# Altium project TinyTOF-Body.PrjPcb
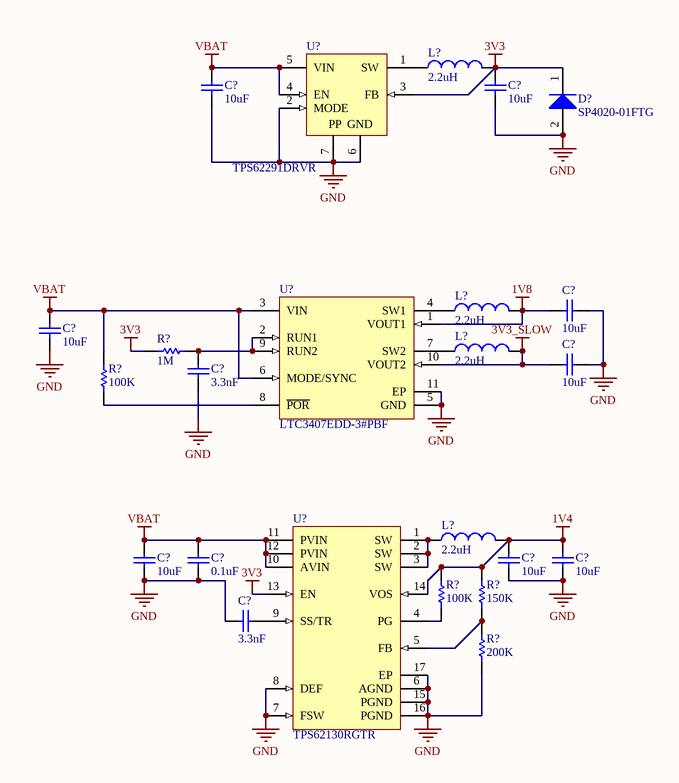
[diagram p0: Supplies.SchDoc]
4 sheets, 103 parts. Net scope: flat (ports and power ports of the same name join across sheets).
Board file: TinyTOF-Body.PcbDoc
Sheets:
  Supplies.SchDoc
  MPU-Power.SchDoc
  MPU-Memory.SchDoc
  MPU-Control.SchDoc

## Sheet Supplies.SchDoc
size A

### Parts
(Parts that share a designator on the sheet are numbered #1, #2 ... from top to bottom, then left to right.)
C61  value 10uF  [C0402[1005X55]]  (hidden comment: 10uF 6.3V 0402)
C62  value 10uF  [C0402[1005X55]]  (hidden comment: 10uF 6.3V 0402)
C63  value 10uF  [C0402[1005X55]]  (hidden comment: 10uF 6.3V 0402)
C64  value 10uF  [C0402[1005X55]]  (hidden comment: 10uF 6.3V 0402)
C65  value 10uF  [C0402[1005X55]]  (hidden comment: 10uF 6.3V 0402)
C66  value 3.3nF  [C0402[1005X55]]  (hidden comment: 3.3nF 50V 0402)
C67  value 10uF  [C0402[1005X55]]  (hidden comment: 10uF 6.3V 0402)
C68  value 0.1uF  [C0402[1005X55]]  (hidden comment: 0.1uF 6.3V 0402)
C69  value 10uF  [C0402[1005X55]]  (hidden comment: 10uF 6.3V 0402)
C70  value 10uF  [C0402[1005X55]]  (hidden comment: 10uF 6.3V 0402)
C71  value 3.3nF  [C0402[1005X55]]  (hidden comment: 3.3nF 50V 0402)
D?  SP4020-01FTG  [SOD323]
L1  2.2uH  [IND0805]
L2  2.2uH  [IND0603]
L3  2.2uH  [IND0603]
L4  2.2uH  [IND1008]
R22  value 1M  [R0402[1005]]  (hidden comment: 1M 1% 0402)
R23  value 150K  [R0402[1005]]  (hidden comment: 150K 1% 0402)
R24  value 200K  [R0402[1005]]  (hidden comment: 200K 1% 0402)
R?#1  value 100K  [R0402[1005]]  (hidden comment: 100K 1% 0402)
R?#2  value 100K  [R0402[1005]]  (hidden comment: 100K 1% 0402)
U6  TPS62291DRVR  [WSON-6]
U7  LTC3407EDD-3#PBF  [LT-DD-10_V]
U8  TPS62130RGTR  [RGT0016C_V]

### Nets
1V4: C69.2 C70.2 L4.2 R23.2 R?#2.2 U8.14(VOS)
1V8: C63.2 L2.2 U7.1(VOUT1)
3V3: C62.2 D?.1(K) L1.2 R22.2 U6.3(FB) U8.13(EN)
3V3_SLOW: C65.1 L3.2 U7.10(VOUT2)
GND: C61.1 C62.1 C63.1 C64.1 C65.2 C66.1 C67.1 C68.1 C69.1 C70.1 C71.1 D?.2(A) R24.1 U6.2(MODE) U6.6(GND) U6.7(EP) U7.5(GND) U7.11(EP) U8.6(AGND) U8.7(FSW) U8.8(DEF) U8.15(PGND) U8.16(PGND) U8.17(EP)
VBAT: C61.2 C64.2 C67.2 C68.2 R?#1.2 U6.4(EN) U6.5(VIN) U7.3(VIN) U7.6(MODE/SYNC) U8.10(AVIN) U8.11(PVIN) U8.12(PVIN)
NetC66_2: C66.2 R22.1 U7.2(RUN1) U7.9(RUN2)
NetC71_2: C71.2 U8.9(SS/TR)
NetL1_1: L1.1 U6.1(SW)
NetL2_1: L2.1 U7.4(SW1)
NetL3_1: L3.1 U7.7(SW2)
NetL4_1: L4.1 U8.1(SW) U8.2(SW) U8.3(SW)
NetR23_1: R23.1 R24.2 U8.5(FB)
NetR?#1_1: R?#1.1 U7.8(~{POR})
NetR?#2_1: R?#2.1 U8.4(PG)

### Notes on the sheet
- (in symbol TPS62291DRVR) PP

### Library data of the parts
C61-C65 C67 C69 C70 = CAP_10uF_6.3V_0402_20%: 10uF 6.3V 20% 0402 (1005 Metric); PartNumber: GRM155R60J106ME44D; Manufacturer: Murata; Tolerance: 20%; Mounting Technology: Surface Mount; PackageReference: 0402; PackageDescription: 0402 (1005 Metric); Voltage: 6.3V
C66 C71 = CAP_3.3nF_50V_0402_10%: 3.3nF 50V 10% 0402 (1005 Metric); PartNumber: GRM155R71H332KA01D; Manufacturer: Murata; Mounting Technology: Surface Mount; PackageReference: 0402; PackageDescription: 0402 (1005 Metric); Voltage: 50V; Tolerance: 10%
C68 = CAP_0.1uF_6.3V_0402_10%: 0.1uF 6.3V 10% 0402 (1005 Metric); PartNumber: GRM155R70J104KA01D; Manufacturer: Murata; Mounting Technology: Surface Mount; PackageReference: 0402; PackageDescription: 0402 (1005 Metric); Voltage: 6.3V; Tolerance: 10%
D? = SP4020-01FTG: Manufacturer: Littelfuse; PartNumber: SP4020-01FTG; PackageReference: SOD-323-2; Mounting Technology: Surface Mount
L1 = IND_2.2uH_1.7A_0805_20%: 2.2uH 20% 1.7A 0805; PartNumber: LQM21PN2R2MGHL; Manufacturer: Murata; PackageReference: 0805; PackageDescription: 0805 (2012 metric); Value: 2.2uH; Mounting Technology: Surface Mount; Current: 1.7A
L2 L3 = IND_2.2uH_750mA_0603_20%: 2.2uH 20% 750mA 0603; PartNumber: LQM18PZ2R2MCHD; Manufacturer: Murata; PackageReference: 0603; PackageDescription: 0603 (1608 metric); Value: 2.2uH; Mounting Technology: Surface Mount; Current: 750mA
L4 = IND_2.2uH_3.3A_1008_20%: 2.2uH 20% 3.3A 1008; PartNumber: DFE252012F-2R2M=P2; Manufacturer: Murata; PackageReference: 1008; PackageDescription: 1008 (2520 metric); Mounting Technology: Surface Mount; Current: 3.3A; Value: 2.2uH
R22 = RES_1M_0402_1%: 1M 0.063W 1% 0402 (1005 Metric); Manufacturer: KOA Speer; PartNumber: RK73H1ETTP1004F; Tolerance: 1%; Power: 0.063W; Mounting Technology: Surface Mount; PackageReference: 0402; PackageDescription: 0402 (1005 Metric); ComponentLink1Description: Datasheet; ComponentLink1URL: http://www.koaspeer.com/catimages/Products/RK73H/RK73H.pdf
R23 = RES_150K_0402_1%: 150K 0.063W 1% 0402 (1005 Metric); Manufacturer: KOA Speer; PartNumber: RK73H1ETTP1503F; Tolerance: 1%; Power: 0.063W; Mounting Technology: Surface Mount; PackageReference: 0402; PackageDescription: 0402 (1005 Metric); ComponentLink1Description: Datasheet; ComponentLink1URL: http://www.koaspeer.com/catimages/Products/RK73H/RK73H.pdf
R24 = RES_200K_0402_1%: 200K 0.063W 1% 0402 (1005 Metric); Manufacturer: KOA Speer; PartNumber: RK73H1ETTP2003F; Tolerance: 1%; Power: 0.063W; Mounting Technology: Surface Mount; PackageReference: 0402; PackageDescription: 0402 (1005 Metric); ComponentLink1Description: Datasheet; ComponentLink1URL: http://www.koaspeer.com/catimages/Products/RK73H/RK73H.pdf
R?#1 R?#2 = RES_100K_0402_1%: 100K 0.063W 1% 0402 (1005 Metric); Manufacturer: KOA Speer; PartNumber: RK73H1ETTP1003F; Tolerance: 1%; Power: 0.063W; Mounting Technology: Surface Mount; PackageReference: 0402; PackageDescription: 0402 (1005 Metric); ComponentLink1Description: Datasheet; ComponentLink1URL: http://www.koaspeer.com/catimages/Products/RK73H/RK73H.pdf
U6 = TPS62291DRVR: Voltage Regulators - Switching Regulators 2.25MHz 1A Step-Down Cnvrtr 3.3V Output; Manufacturer: Texas Instruments; PartNumber: TPS62291DRVR; PackageReference: WSON-6; PackageDescription: SON, 6-Leads, Body 2x2mm, Pitch 0.65mm, Thermal Pad 1.6x1mm, TI Recommended; Mounting Technology: Surface Mount
U7 = CMP-0492-00137-1: Dual Synchronous 800 mA, 2.25 MHz Step-Down DC/DC Regulator, 10-pin SON (DD-10), -40 to 85 degC, Pb-Free; Manufacturer: Linear Technology; Number of Outputs: 2; DatasheetVersion: Rev. B; ComponentLink1URL: http://www.linear.com/; PackageDescription: 10-Pin Plastic DFN, Body 3 x 3 mm, Pitch 0.5 mm; PartNumber: LTC3407EDD-3#PBF; ComponentLink3Description: Package Specification; PackageVersion: Rev. C, 06/2010; ComponentLink2Description: Datasheet; Frequency Sync Range: 2.25MHz; ComponentLink2URL: http://cds.linear.com/docs/en/datasheet/34073fb.pdf; Code_JEDEC: MO-229; RoHS: TRUE; ComponentLink3URL: http://cds.linear.com/docs/en/packaging/DFN_10_05-08-1699.pdf; ComponentLink1Description: Manufacturer URL; PackageReference: DD-10; Mounting Technology: Surface Mount
U8 = CMP-0323-00115-3: Buck Step Down Regulator with 3 to 17 V Input and 0.9 to 6 V Output, -40 to 85 degC, 16-Pin QFN (RGT), Green (RoHS & no Sb/Br); Manufacturer: Texas Instruments; Rating: Catalog; Vout(Max)(V): 6; Vin(Min)(V): 3; Switch Current Limit(Typ)(A): 4.2; Iq(Typ)(mA): 0.017; Regulated Outputs(#): 1; Synchronous Rectification: TRUE; SubFamily: Step-Down Regulator; Vin(Max)(V): 17; Duty Cycle(Max)(%): 100; Vout(Min)(V): 0.9; ComponentLink2URL: http://www.ti.com/litv/pdf/mpqf119g; Eco-Plan: Green (RoHS & no Sb/Br); PartNumber: TPS62130RGTR; ComponentLink1Description: Datasheet; DatasheetVersion: SLVSAG7; Mounting Technology: Surface Mount; Iout(Max)(A): 3; ComponentLink2Description: Package Specification; Code_JEDEC: MO-220; Topology: Buck; ComponentLink1URL: http://www.ti.com/general/docs/lit/getliterature.tsp?genericPartNumber=TPS62130&fileType=pdf; ComponentLink3URL: Samples URL:http://www.ti.com/product/tps62130#samples; ComponentLink3Description: URL Link1; PackageReference: RGT0016C; PackageVersion: revH, Oct-2011; PackageDescription: 16-Pin Plastic Quad Flat No-Lead, 3 x 3 mm Body, 0.5 mm Pitch, 1.7 x 1.7 mm Exposed Pad

## Sheet MPU-Power.SchDoc
size B
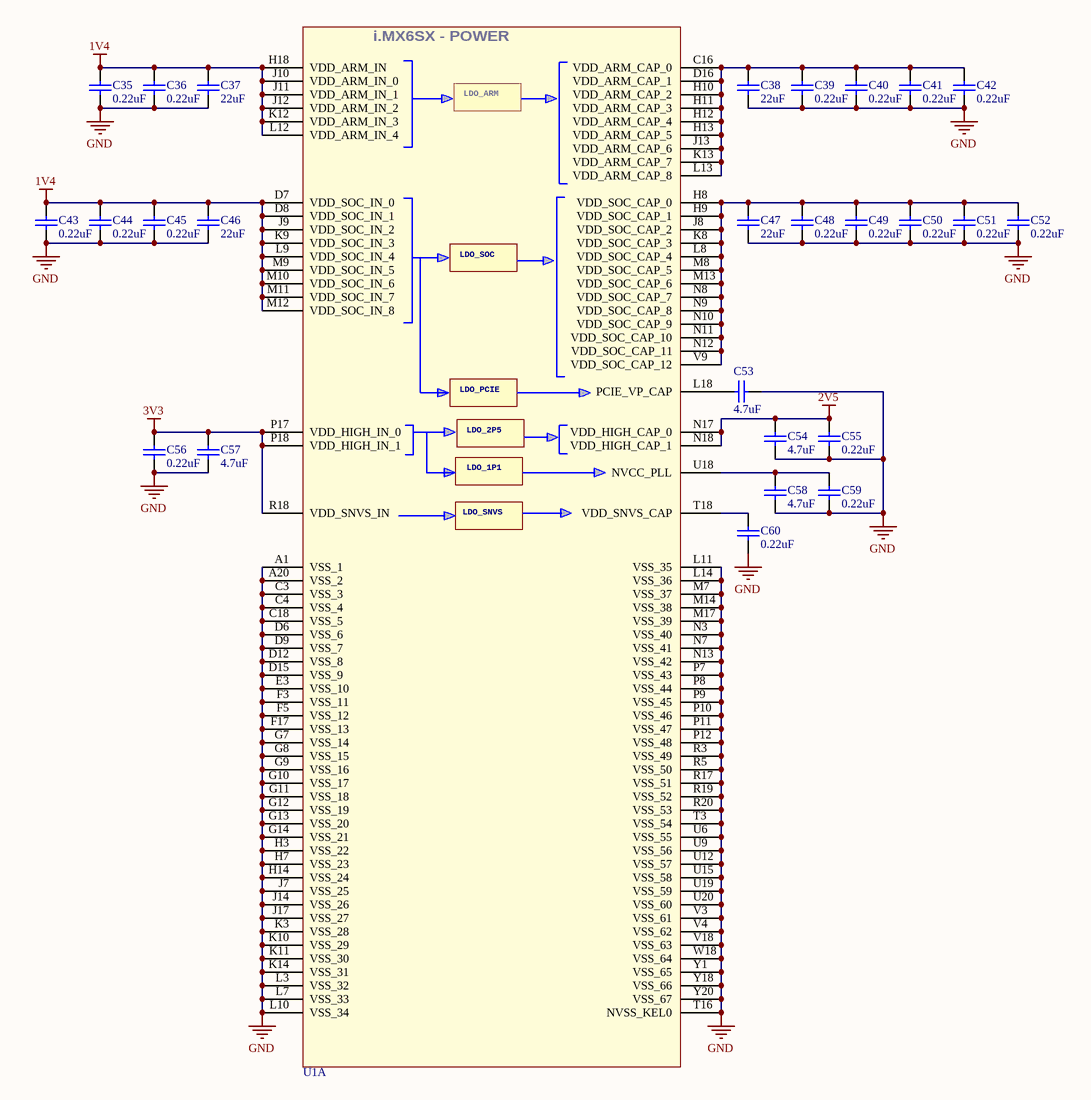
[diagram p1: MPU-Power.SchDoc]

### Parts
C35  value 0.22uF  [C0402[1005X55]]  (hidden comment: 0.22uF 6.3V 0402)
C36  value 0.22uF  [C0402[1005X55]]  (hidden comment: 0.22uF 6.3V 0402)
C37  value 22uF  [C0603[1608X92]]  (hidden comment: 22uF 6.3V 0603)
C38  value 22uF  [C0603[1608X92]]  (hidden comment: 22uF 6.3V 0603)
C39  value 0.22uF  [C0402[1005X55]]  (hidden comment: 0.22uF 6.3V 0402)
C40  value 0.22uF  [C0402[1005X55]]  (hidden comment: 0.22uF 6.3V 0402)
C41  value 0.22uF  [C0402[1005X55]]  (hidden comment: 0.22uF 6.3V 0402)
C42  value 0.22uF  [C0402[1005X55]]  (hidden comment: 0.22uF 6.3V 0402)
C43  value 0.22uF  [C0402[1005X55]]  (hidden comment: 0.22uF 6.3V 0402)
C44  value 0.22uF  [C0402[1005X55]]  (hidden comment: 0.22uF 6.3V 0402)
C45  value 0.22uF  [C0402[1005X55]]  (hidden comment: 0.22uF 6.3V 0402)
C46  value 22uF  [C0603[1608X92]]  (hidden comment: 22uF 6.3V 0603)
C47  value 22uF  [C0603[1608X92]]  (hidden comment: 22uF 6.3V 0603)
C48  value 0.22uF  [C0402[1005X55]]  (hidden comment: 0.22uF 6.3V 0402)
C49  value 0.22uF  [C0402[1005X55]]  (hidden comment: 0.22uF 6.3V 0402)
C50  value 0.22uF  [C0402[1005X55]]  (hidden comment: 0.22uF 6.3V 0402)
C51  value 0.22uF  [C0402[1005X55]]  (hidden comment: 0.22uF 6.3V 0402)
C52  value 0.22uF  [C0402[1005X55]]  (hidden comment: 0.22uF 6.3V 0402)
C53  value 4.7uF  [C0402[1005X55]]  (hidden comment: 4.7uF 6.3V 0402)
C54  value 4.7uF  [C0402[1005X55]]  (hidden comment: 4.7uF 6.3V 0402)
C55  value 0.22uF  [C0402[1005X55]]  (hidden comment: 0.22uF 6.3V 0402)
C56  value 0.22uF  [C0402[1005X55]]  (hidden comment: 0.22uF 6.3V 0402)
C57  value 4.7uF  [C0402[1005X55]]  (hidden comment: 4.7uF 6.3V 0402)
C58  value 4.7uF  [C0402[1005X55]]  (hidden comment: 4.7uF 6.3V 0402)
C59  value 0.22uF  [C0402[1005X55]]  (hidden comment: 0.22uF 6.3V 0402)
C60  value 0.22uF  [C0402[1005X55]]  (hidden comment: 0.22uF 6.3V 0402)
U1  MCIMX6X3EVO10AB  [BGA-400]  (value not drawn)  (part A of 12)

### Nets
1V4: C35.2 C36.2 C37.2 C43.2 C44.2 C45.2 C46.2 U1.D7(VDD_SOC_IN_0) U1.D8(VDD_SOC_IN_1) U1.H18(VDD_ARM_IN) U1.J9(VDD_SOC_IN_2) U1.J10(VDD_ARM_IN_0) U1.J11(VDD_ARM_IN_1) U1.J12(VDD_ARM_IN_2) U1.K9(VDD_SOC_IN_3) U1.K12(VDD_ARM_IN_3) U1.L9(VDD_SOC_IN_4) U1.L12(VDD_ARM_IN_4) U1.M9(VDD_SOC_IN_5) U1.M10(VDD_SOC_IN_6) U1.M11(VDD_SOC_IN_7) U1.M12(VDD_SOC_IN_8)
2V5: C54.2 C55.2 U1.N17(VDD_HIGH_CAP_0) U1.N18(VDD_HIGH_CAP_1)
3V3: C56.2 C57.2 U1.P17(VDD_HIGH_IN_0) U1.P18(VDD_HIGH_IN_1) U1.R18(VDD_SNVS_IN)
GND: C35.1 C36.1 C37.1 C38.1 C39.1 C40.1 C41.1 C42.1 C43.1 C44.1 C45.1 C46.1 C47.1 C48.1 C49.1 C50.1 C51.1 C52.1 C53.1 C54.1 C55.1 C56.1 C57.1 C58.1 C59.1 C60.1 U1.A1(VSS_1) U1.A20(VSS_2) U1.C3(VSS_3) U1.C4(VSS_4) U1.C18(VSS_5) U1.D6(VSS_6) U1.D9(VSS_7) U1.D12(VSS_8) U1.D15(VSS_9) U1.E3(VSS_10) U1.F3(VSS_11) U1.F5(VSS_12) U1.F17(VSS_13) U1.G7(VSS_14) U1.G8(VSS_15) U1.G9(VSS_16) U1.G10(VSS_17) U1.G11(VSS_18) U1.G12(VSS_19) U1.G13(VSS_20) U1.G14(VSS_21) U1.H3(VSS_22) U1.H7(VSS_23) U1.H14(VSS_24) U1.J7(VSS_25) U1.J14(VSS_26) U1.J17(VSS_27) U1.K3(VSS_28) U1.K10(VSS_29) U1.K11(VSS_30) U1.K14(VSS_31) U1.L3(VSS_32) U1.L7(VSS_33) U1.L10(VSS_34) U1.L11(VSS_35) U1.L14(VSS_36) U1.M7(VSS_37) U1.M14(VSS_38) U1.M17(VSS_39) U1.N3(VSS_40) U1.N7(VSS_41) U1.N13(VSS_42) U1.P7(VSS_43) U1.P8(VSS_44) U1.P9(VSS_45) U1.P10(VSS_46) U1.P11(VSS_47) U1.P12(VSS_48) U1.R3(VSS_49) U1.R5(VSS_50) U1.R17(VSS_51) U1.R19(VSS_52) U1.R20(VSS_53) U1.T3(VSS_54) U1.T16(NVSS_KEL0) U1.U6(VSS_55) U1.U9(VSS_56) U1.U12(VSS_57) U1.U15(VSS_58) U1.U19(VSS_59) U1.U20(VSS_60) U1.V3(VSS_61) U1.V4(VSS_62) U1.V18(VSS_63) U1.W18(VSS_64) U1.Y1(VSS_65) U1.Y18(VSS_66) U1.Y20(VSS_67)
NetC38_2: C38.2 C39.2 C40.2 C41.2 C42.2 U1.C16(VDD_ARM_CAP_0) U1.D16(VDD_ARM_CAP_1) U1.H10(VDD_ARM_CAP_2) U1.H11(VDD_ARM_CAP_3) U1.H12(VDD_ARM_CAP_4) U1.H13(VDD_ARM_CAP_5) U1.J13(VDD_ARM_CAP_6) U1.K13(VDD_ARM_CAP_7) U1.L13(VDD_ARM_CAP_8)
NetC47_2: C47.2 C48.2 C49.2 C50.2 C51.2 C52.2 U1.H8(VDD_SOC_CAP_0) U1.H9(VDD_SOC_CAP_1) U1.J8(VDD_SOC_CAP_2) U1.K8(VDD_SOC_CAP_3) U1.L8(VDD_SOC_CAP_4) U1.M8(VDD_SOC_CAP_5) U1.M13(VDD_SOC_CAP_6) U1.N8(VDD_SOC_CAP_7) U1.N9(VDD_SOC_CAP_8) U1.N10(VDD_SOC_CAP_9) U1.N11(VDD_SOC_CAP_10) U1.N12(VDD_SOC_CAP_11) U1.V9(VDD_SOC_CAP_12)
NetC53_2: C53.2 U1.L18(PCIE_VP_CAP)
NetC58_2: C58.2 C59.2 U1.U18(NVCC_PLL)
NetC60_2: C60.2 U1.T18(VDD_SNVS_CAP)

### Notes on the sheet
- (in symbol MCIMX6X3EVO10AB, part A) i.MX6SX - POWER; LDO_ARM; LDO_SOC; LDO_PCIE; LDO_2P5; LDO_1P1; LDO_SNVS

### Library data of the parts
C35 C36 C39-C45 C48-C52 C55 C56 C59 C60 = CAP_0.22uF_6.3V_0402_10%: 0.22uF 6.3V 10% 0402 (1005 Metric); PartNumber: JMK105BJ224KV-F; Manufacturer: Taiyo Yuden; Mounting Technology: Surface Mount; PackageReference: 0402; PackageDescription: 0402 (1005 Metric); Voltage: 6.3V; Tolerance: 10%
C37 C38 C46 C47 = CAP_22uF_6.3V_0603_10%: 22uF 6.3V 10% 0603 (1608 Metric); PartNumber: GRT188R60J226ME13D; Manufacturer: Murata; Mounting Technology: Surface Mount; PackageReference: 0603; PackageDescription: 0603 (1608 Metric); Voltage: 6.3V; Tolerance: 10%
C53 C54 C57 C58 = CAP_4.7uF_6.3V_0402_20%: 4.7uF 6.3V 20% 0402 (1005 Metric); PartNumber: GRM155R60J475ME47D; Manufacturer: Murata; Mounting Technology: Surface Mount; PackageReference: 0402; PackageDescription: 0402 (1005 Metric); Voltage: 6.3V; Tolerance: 20%
U1 = MCIMX6X3EVO10AB: IC MPU I.MX6SX 1GHZ 400MAPBGA; Manufacturer: NXP; PartNumber: MCIMX6X3EVO10AB; Mounting Technology: Surface Mount; PackageReference: BGA-400

## Sheet MPU-Memory.SchDoc
size C
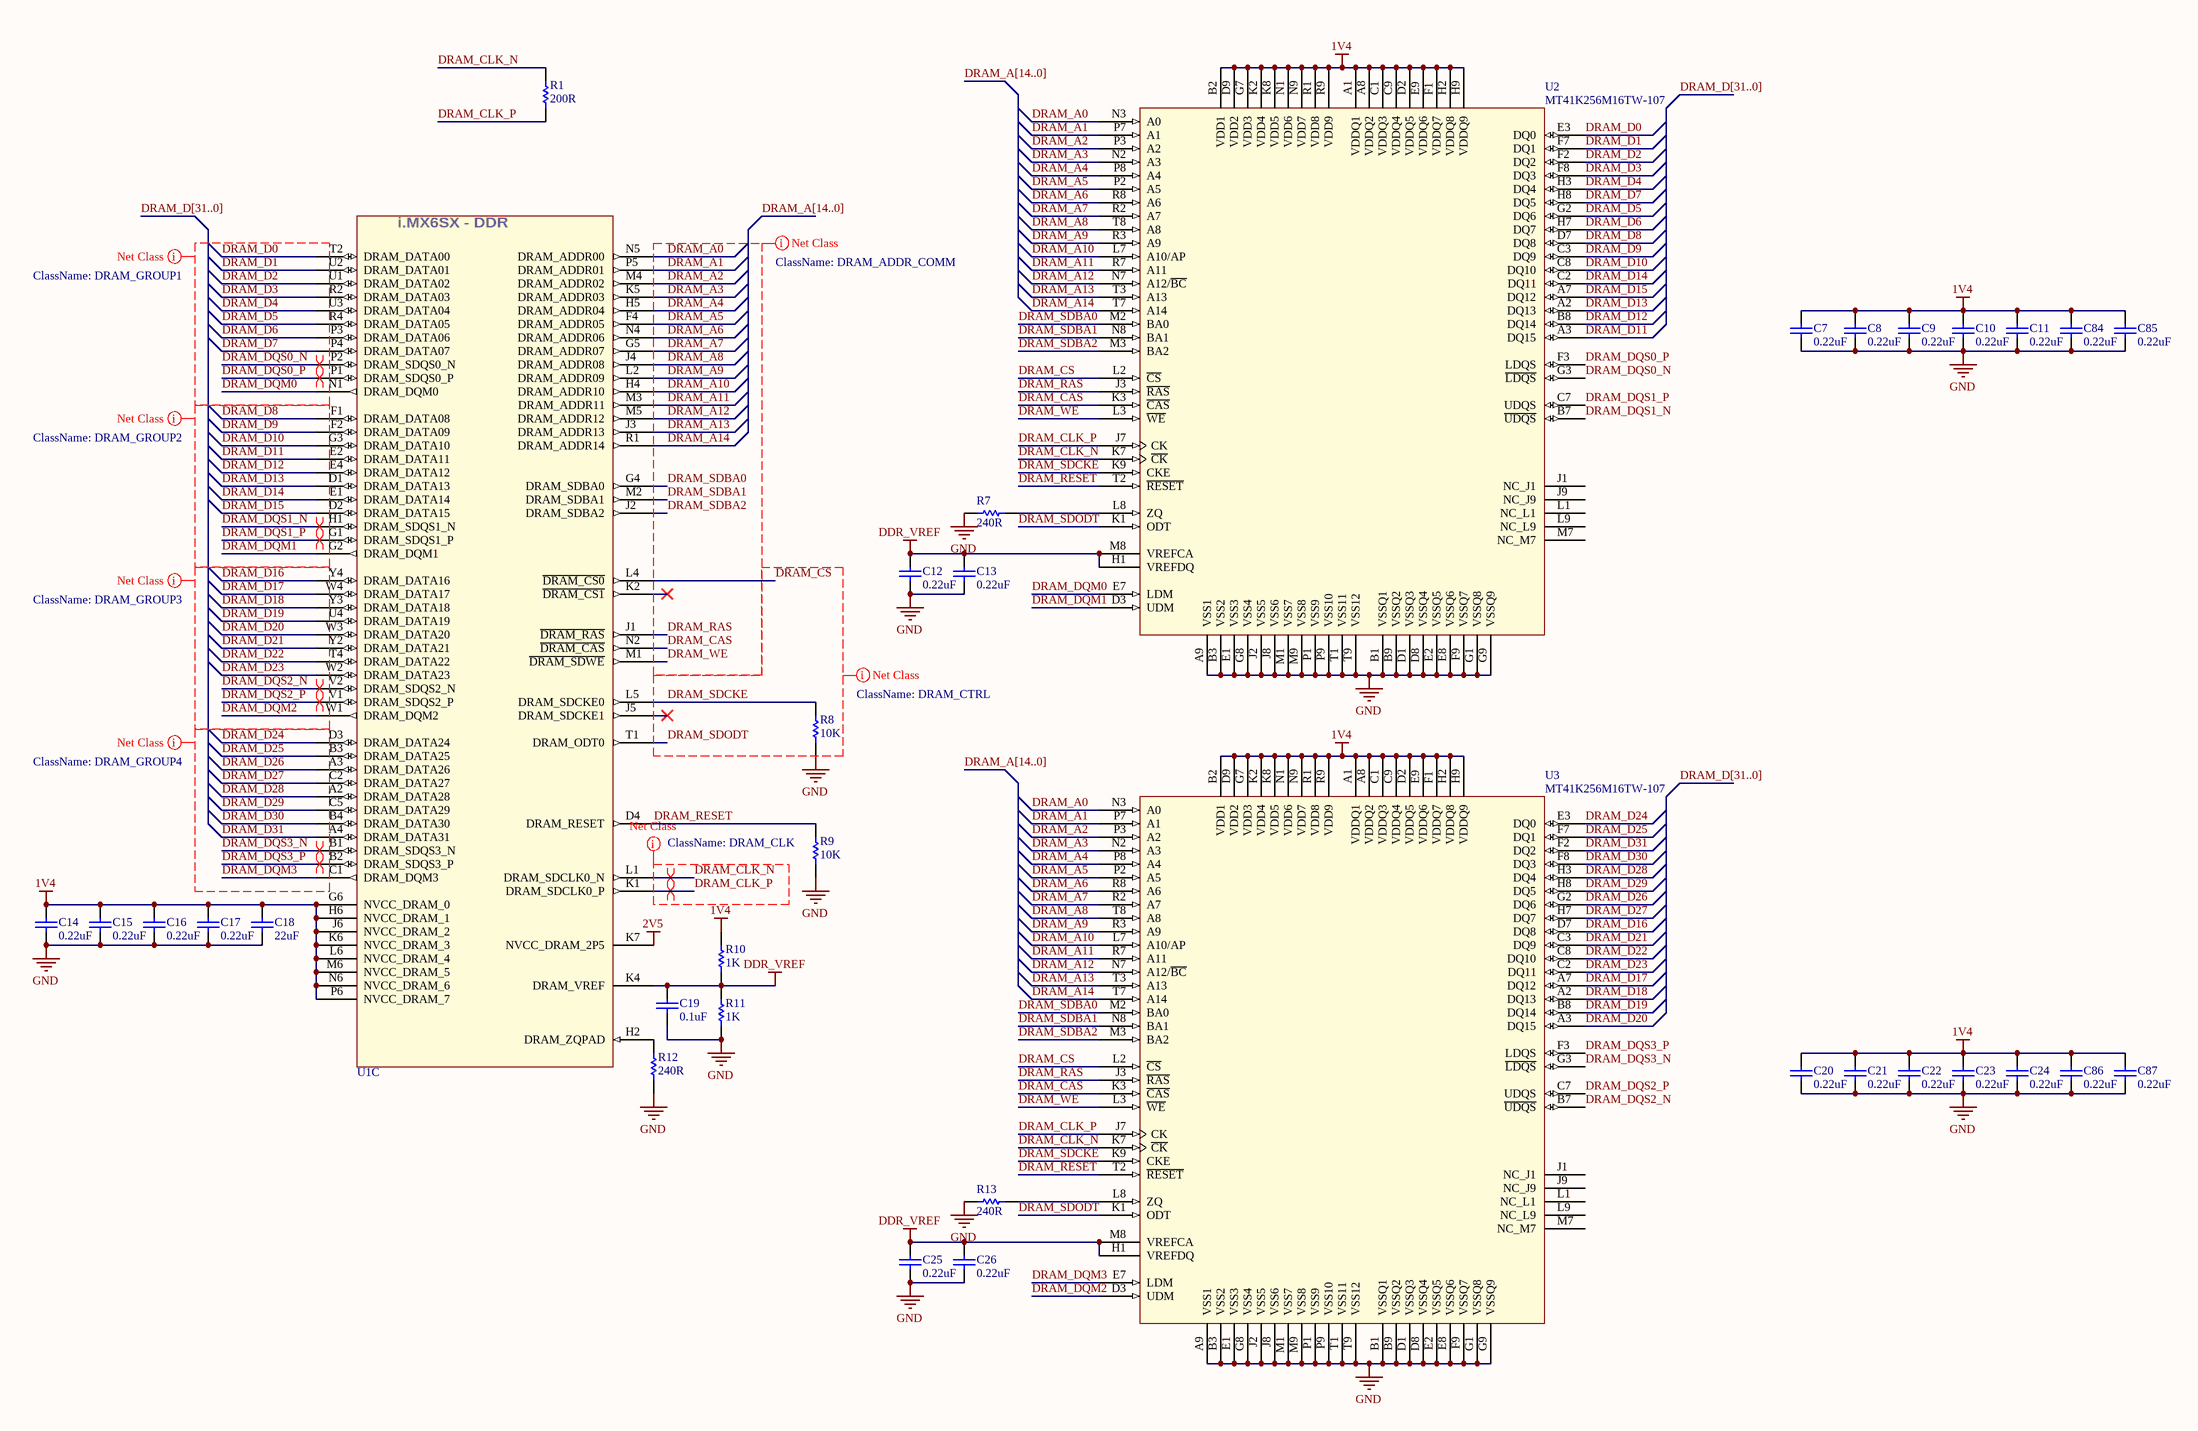
[diagram p2: MPU-Memory.SchDoc]

### Parts
C7  value 0.22uF  [C0402[1005X55]]  (hidden comment: 0.22uF 6.3V 0402)
C8  value 0.22uF  [C0402[1005X55]]  (hidden comment: 0.22uF 6.3V 0402)
C9  value 0.22uF  [C0402[1005X55]]  (hidden comment: 0.22uF 6.3V 0402)
C10  value 0.22uF  [C0402[1005X55]]  (hidden comment: 0.22uF 6.3V 0402)
C11  value 0.22uF  [C0402[1005X55]]  (hidden comment: 0.22uF 6.3V 0402)
C12  value 0.22uF  [C0402[1005X55]]  (hidden comment: 0.22uF 6.3V 0402)
C13  value 0.22uF  [C0402[1005X55]]  (hidden comment: 0.22uF 6.3V 0402)
C14  value 0.22uF  [C0402[1005X55]]  (hidden comment: 0.22uF 6.3V 0402)
C15  value 0.22uF  [C0402[1005X55]]  (hidden comment: 0.22uF 6.3V 0402)
C16  value 0.22uF  [C0402[1005X55]]  (hidden comment: 0.22uF 6.3V 0402)
C17  value 0.22uF  [C0402[1005X55]]  (hidden comment: 0.22uF 6.3V 0402)
C18  value 22uF  [C0603[1608X92]]  (hidden comment: 22uF 6.3V 0603)
C19  value 0.1uF  [C0402[1005X55]]  (hidden comment: 0.1uF 6.3V 0402)
C20  value 0.22uF  [C0402[1005X55]]  (hidden comment: 0.22uF 6.3V 0402)
C21  value 0.22uF  [C0402[1005X55]]  (hidden comment: 0.22uF 6.3V 0402)
C22  value 0.22uF  [C0402[1005X55]]  (hidden comment: 0.22uF 6.3V 0402)
C23  value 0.22uF  [C0402[1005X55]]  (hidden comment: 0.22uF 6.3V 0402)
C24  value 0.22uF  [C0402[1005X55]]  (hidden comment: 0.22uF 6.3V 0402)
C25  value 0.22uF  [C0402[1005X55]]  (hidden comment: 0.22uF 6.3V 0402)
C26  value 0.22uF  [C0402[1005X55]]  (hidden comment: 0.22uF 6.3V 0402)
C84  value 0.22uF  [C0402[1005X55]]  (hidden comment: 0.22uF 6.3V 0402)
C85  value 0.22uF  [C0402[1005X55]]  (hidden comment: 0.22uF 6.3V 0402)
C86  value 0.22uF  [C0402[1005X55]]  (hidden comment: 0.22uF 6.3V 0402)
C87  value 0.22uF  [C0402[1005X55]]  (hidden comment: 0.22uF 6.3V 0402)
R1  value 200R  [R0402[1005]]  (hidden comment: 200R 1% 0402)
R7  value 240R  [R0402[1005]]  (hidden comment: 240R 1% 0402)
R8  value 10K  [R0402[1005]]  (hidden comment: 10K 1% 0402)
R9  value 10K  [R0402[1005]]  (hidden comment: 10K 1% 0402)
R10  value 1K  [R0402[1005]]  (hidden comment: 1K 1% 0402)
R11  value 1K  [R0402[1005]]  (hidden comment: 1K 1% 0402)
R12  value 240R  [R0402[1005]]  (hidden comment: 240R 1% 0402)
R13  value 240R  [R0402[1005]]  (hidden comment: 240R 1% 0402)
U1  MCIMX6X3EVO10AB  [BGA-400]  (value not drawn)  (part C of 12)
U2  MT41K256M16TW-107  [BGA-96]
U3  MT41K256M16TW-107  [BGA-96]

### Nets
1V4: C7.2 C8.2 C9.2 C10.2 C11.2 C14.2 C15.2 C16.2 C17.2 C18.2 C20.2 C21.2 C22.2 C23.2 C24.2 C84.2 C85.2 C86.2 C87.2 R10.2 U1.G6(NVCC_DRAM_0) U1.H6(NVCC_DRAM_1) U1.J6(NVCC_DRAM_2) U1.K6(NVCC_DRAM_3) U1.L6(NVCC_DRAM_4) U1.M6(NVCC_DRAM_5) U1.N6(NVCC_DRAM_6) U1.P6(NVCC_DRAM_7) U2.A1(VDDQ1) U2.A8(VDDQ2) U2.B2(VDD1) U2.C1(VDDQ3) U2.C9(VDDQ4) U2.D2(VDDQ5) U2.D9(VDD2) U2.E9(VDDQ6) U2.F1(VDDQ7) U2.G7(VDD3) U2.H2(VDDQ8) U2.H9(VDDQ9) U2.K2(VDD4) U2.K8(VDD5) U2.N1(VDD6) U2.N9(VDD7) U2.R1(VDD8) U2.R9(VDD9) U3.A1(VDDQ1) U3.A8(VDDQ2) U3.B2(VDD1) U3.C1(VDDQ3) U3.C9(VDDQ4) U3.D2(VDDQ5) U3.D9(VDD2) U3.E9(VDDQ6) U3.F1(VDDQ7) U3.G7(VDD3) U3.H2(VDDQ8) U3.H9(VDDQ9) U3.K2(VDD4) U3.K8(VDD5) U3.N1(VDD6) U3.N9(VDD7) U3.R1(VDD8) U3.R9(VDD9)
2V5: U1.K7(NVCC_DRAM_2P5)
DDR_VREF: C12.2 C13.2 C19.2 C25.2 C26.2 R10.1 R11.2 U1.K4(DRAM_VREF) U2.H1(VREFDQ) U2.M8(VREFCA) U3.H1(VREFDQ) U3.M8(VREFCA)
GND: C7.1 C8.1 C9.1 C10.1 C11.1 C12.1 C13.1 C14.1 C15.1 C16.1 C17.1 C18.1 C19.1 C20.1 C21.1 C22.1 C23.1 C24.1 C25.1 C26.1 C84.1 C85.1 C86.1 C87.1 R7.2 R8.1 R9.1 R11.1 R12.1 R13.2 U2.A9(VSS1) U2.B1(VSSQ1) U2.B3(VSS2) U2.B9(VSSQ2) U2.D1(VSSQ3) U2.D8(VSSQ4) U2.E1(VSS3) U2.E2(VSSQ5) U2.E8(VSSQ6) U2.F9(VSSQ7) U2.G1(VSSQ8) U2.G8(VSS4) U2.G9(VSSQ9) U2.J2(VSS5) U2.J8(VSS6) U2.M1(VSS7) U2.M9(VSS8) U2.P1(VSS9) U2.P9(VSS10) U2.T1(VSS11) U2.T9(VSS12) U3.A9(VSS1) U3.B1(VSSQ1) U3.B3(VSS2) U3.B9(VSSQ2) U3.D1(VSSQ3) U3.D8(VSSQ4) U3.E1(VSS3) U3.E2(VSSQ5) U3.E8(VSSQ6) U3.F9(VSSQ7) U3.G1(VSSQ8) U3.G8(VSS4) U3.G9(VSSQ9) U3.J2(VSS5) U3.J8(VSS6) U3.M1(VSS7) U3.M9(VSS8) U3.P1(VSS9) U3.P9(VSS10) U3.T1(VSS11) U3.T9(VSS12)
DRAM_A0: U1.N5(DRAM_ADDR00) U2.N3(A0) U3.N3(A0)
DRAM_A1: U1.P5(DRAM_ADDR01) U2.P7(A1) U3.P7(A1)
DRAM_A2: U1.M4(DRAM_ADDR02) U2.P3(A2) U3.P3(A2)
DRAM_A3: U1.K5(DRAM_ADDR03) U2.N2(A3) U3.N2(A3)
DRAM_A4: U1.H5(DRAM_ADDR04) U2.P8(A4) U3.P8(A4)
DRAM_A5: U1.F4(DRAM_ADDR05) U2.P2(A5) U3.P2(A5)
DRAM_A6: U1.N4(DRAM_ADDR06) U2.R8(A6) U3.R8(A6)
DRAM_A7: U1.G5(DRAM_ADDR07) U2.R2(A7) U3.R2(A7)
DRAM_A8: U1.J4(DRAM_ADDR08) U2.T8(A8) U3.T8(A8)
DRAM_A9: U1.L2(DRAM_ADDR09) U2.R3(A9) U3.R3(A9)
DRAM_A10: U1.H4(DRAM_ADDR10) U2.L7(A10/AP) U3.L7(A10/AP)
DRAM_A11: U1.M3(DRAM_ADDR11) U2.R7(A11) U3.R7(A11)
DRAM_A12: U1.M5(DRAM_ADDR12) U2.N7(A12/~{BC}) U3.N7(A12/~{BC})
DRAM_A13: U1.J3(DRAM_ADDR13) U2.T3(A13) U3.T3(A13)
DRAM_A14: U1.R1(DRAM_ADDR14) U2.T7(A14) U3.T7(A14)
DRAM_CAS: U1.N2(~{DRAM_CAS}) U2.K3(~{CAS}) U3.K3(~{CAS})
DRAM_CLK_N: R1.2 U1.L1(DRAM_SDCLK0_N) U2.K7(~{CK}) U3.K7(~{CK})
DRAM_CLK_P: R1.1 U1.K1(DRAM_SDCLK0_P) U2.J7(CK) U3.J7(CK)
DRAM_CS: U1.L4(~{DRAM_CS0}) U2.L2(~{CS}) U3.L2(~{CS})
DRAM_D0: U1.T2(DRAM_DATA00) U2.E3(DQ0)
DRAM_D1: U1.U2(DRAM_DATA01) U2.F7(DQ1)
DRAM_D2: U1.U1(DRAM_DATA02) U2.F2(DQ2)
DRAM_D3: U1.R2(DRAM_DATA03) U2.F8(DQ3)
DRAM_D4: U1.U3(DRAM_DATA04) U2.H3(DQ4)
DRAM_D5: U1.R4(DRAM_DATA05) U2.G2(DQ6)
DRAM_D6: U1.P3(DRAM_DATA06) U2.H7(DQ7)
DRAM_D7: U1.P4(DRAM_DATA07) U2.H8(DQ5)
DRAM_D8: U1.F1(DRAM_DATA08) U2.D7(DQ8)
DRAM_D9: U1.F2(DRAM_DATA09) U2.C3(DQ9)
DRAM_D10: U1.G3(DRAM_DATA10) U2.C8(DQ10)
DRAM_D11: U1.E2(DRAM_DATA11) U2.A3(DQ15)
DRAM_D12: U1.E4(DRAM_DATA12) U2.B8(DQ14)
DRAM_D13: U1.D1(DRAM_DATA13) U2.A2(DQ13)
DRAM_D14: U1.E1(DRAM_DATA14) U2.C2(DQ11)
DRAM_D15: U1.D2(DRAM_DATA15) U2.A7(DQ12)
DRAM_D16: U1.Y4(DRAM_DATA16) U3.D7(DQ8)
DRAM_D17: U1.W4(DRAM_DATA17) U3.A7(DQ12)
DRAM_D18: U1.Y3(DRAM_DATA18) U3.A2(DQ13)
DRAM_D19: U1.U4(DRAM_DATA19) U3.B8(DQ14)
DRAM_D20: U1.W3(DRAM_DATA20) U3.A3(DQ15)
DRAM_D21: U1.Y2(DRAM_DATA21) U3.C3(DQ9)
DRAM_D22: U1.T4(DRAM_DATA22) U3.C8(DQ10)
DRAM_D23: U1.W2(DRAM_DATA23) U3.C2(DQ11)
DRAM_D24: U1.D3(DRAM_DATA24) U3.E3(DQ0)
DRAM_D25: U1.B3(DRAM_DATA25) U3.F7(DQ1)
DRAM_D26: U1.A3(DRAM_DATA26) U3.G2(DQ6)
DRAM_D27: U1.C2(DRAM_DATA27) U3.H7(DQ7)
DRAM_D28: U1.A2(DRAM_DATA28) U3.H3(DQ4)
DRAM_D29: U1.C5(DRAM_DATA29) U3.H8(DQ5)
DRAM_D30: U1.B4(DRAM_DATA30) U3.F8(DQ3)
DRAM_D31: U1.A4(DRAM_DATA31) U3.F2(DQ2)
DRAM_DQM0: U1.N1(DRAM_DQM0) U2.E7(LDM)
DRAM_DQM1: U1.G2(DRAM_DQM1) U2.D3(UDM)
DRAM_DQM2: U1.W1(DRAM_DQM2) U3.D3(UDM)
DRAM_DQM3: U1.C1(DRAM_DQM3) U3.E7(LDM)
DRAM_DQS0_N: U1.P2(DRAM_SDQS0_N) U2.G3(~{LDQS})
DRAM_DQS0_P: U1.P1(DRAM_SDQS0_P) U2.F3(LDQS)
DRAM_DQS1_N: U1.H1(DRAM_SDQS1_N) U2.B7(~{UDQS})
DRAM_DQS1_P: U1.G1(DRAM_SDQS1_P) U2.C7(UDQS)
DRAM_DQS2_N: U1.V2(DRAM_SDQS2_N) U3.B7(~{UDQS})
DRAM_DQS2_P: U1.V1(DRAM_SDQS2_P) U3.C7(UDQS)
DRAM_DQS3_N: U1.B1(DRAM_SDQS3_N) U3.G3(~{LDQS})
DRAM_DQS3_P: U1.B2(DRAM_SDQS3_P) U3.F3(LDQS)
DRAM_RAS: U1.J1(~{DRAM_RAS}) U2.J3(~{RAS}) U3.J3(~{RAS})
DRAM_RESET: R9.2 U1.D4(DRAM_RESET) U2.T2(~{RESET}) U3.T2(~{RESET})
DRAM_SDBA0: U1.G4(DRAM_SDBA0) U2.M2(BA0) U3.M2(BA0)
DRAM_SDBA1: U1.M2(DRAM_SDBA1) U2.N8(BA1) U3.N8(BA1)
DRAM_SDBA2: U1.J2(DRAM_SDBA2) U2.M3(BA2) U3.M3(BA2)
DRAM_SDCKE: R8.2 U1.L5(DRAM_SDCKE0) U2.K9(CKE) U3.K9(CKE)
DRAM_SDODT: U1.T1(DRAM_ODT0) U2.K1(ODT) U3.K1(ODT)
DRAM_WE: U1.M1(~{DRAM_SDWE}) U2.L3(~{WE}) U3.L3(~{WE})
NetR7_1: R7.1 U2.L8(ZQ)
NetR12_2: R12.2 U1.H2(DRAM_ZQPAD)
NetR13_1: R13.1 U3.L8(ZQ)

Not connected (* = marked no-connect by the designer): U1 J5(DRAM_SDCKE1)* K2(~{DRAM_CS1})*; U2 J1(NC_J1) J9(NC_J9) L1(NC_L1) L9(NC_L9) M7(NC_M7); U3 J1(NC_J1) J9(NC_J9) L1(NC_L1) L9(NC_L9) M7(NC_M7)

### Buses and harness runs
bus DRAM_A[14..0]
bus DRAM_D[31..0]

### Layout directives
differential pair: DRAM_CLK_N, DRAM_CLK_P, DRAM_DQS0_N, DRAM_DQS0_P, DRAM_DQS1_N, DRAM_DQS1_P, DRAM_DQS2_N, DRAM_DQS2_P, DRAM_DQS3_N, DRAM_DQS3_P
net class DRAM_GROUP1: DRAM_D0, DRAM_D1, DRAM_D2, DRAM_D3, DRAM_D4, DRAM_D5, DRAM_D6, DRAM_D7, DRAM_DQM0, DRAM_DQS0_N, DRAM_DQS0_P
net class DRAM_GROUP2: DRAM_D8, DRAM_D9, DRAM_D10, DRAM_D11, DRAM_D12, DRAM_D13, DRAM_D14, DRAM_D15, DRAM_DQM1, DRAM_DQS1_N, DRAM_DQS1_P
net class DRAM_GROUP3: DRAM_D16, DRAM_D17, DRAM_D18, DRAM_D19, DRAM_D20, DRAM_D21, DRAM_D22, DRAM_D23, DRAM_DQM2, DRAM_DQS2_N, DRAM_DQS2_P
net class DRAM_GROUP4: DRAM_D24, DRAM_D25, DRAM_D26, DRAM_D27, DRAM_D28, DRAM_D29, DRAM_D30, DRAM_D31, DRAM_DQM3, DRAM_DQS3_N, DRAM_DQS3_P
net class DRAM_ADDR_COMM: DRAM_A0, DRAM_A1, DRAM_A2, DRAM_A3, DRAM_A4, DRAM_A5, DRAM_A6, DRAM_A7, DRAM_A8, DRAM_A9, DRAM_A10, DRAM_A11, DRAM_A12, DRAM_A13, DRAM_A14, DRAM_CAS, DRAM_RAS, DRAM_SDBA0, DRAM_SDBA1, DRAM_SDBA2, DRAM_WE
net class DRAM_CTRL: DRAM_CS, DRAM_SDCKE, DRAM_SDODT, GND
net class DRAM_CLK: DRAM_CLK_N, DRAM_CLK_P

### Notes on the sheet
- (in symbol MCIMX6X3EVO10AB, part C) i.MX6SX - DDR

### Library data of the parts
C7-C17 C20-C26 C84-C87 = CAP_0.22uF_6.3V_0402_10%: as C35 on sheet MPU-Power; Mounting Technology: Surface Mount; PackageReference: 0402; PackageDescription: 0402 (1005 Metric); Voltage: 6.3V; Tolerance: 10%
C18 = CAP_22uF_6.3V_0603_10%: as C37 on sheet MPU-Power; Mounting Technology: Surface Mount; PackageReference: 0603; PackageDescription: 0603 (1608 Metric); Voltage: 6.3V; Tolerance: 10%
C19 = CAP_0.1uF_6.3V_0402_10%: as C68 on sheet Supplies; Mounting Technology: Surface Mount; PackageReference: 0402; PackageDescription: 0402 (1005 Metric); Voltage: 6.3V; Tolerance: 10%
R1 = RES_200R_0402_1%: 200R 0.063W 1% 0402 (1005 Metric); Manufacturer: KOA Speer; PartNumber: RK73H1ETTP2000F; Tolerance: 1%; Power: 0.063W; Mounting Technology: Surface Mount; PackageReference: 0402; PackageDescription: 0402 (1005 Metric); ComponentLink1Description: Datasheet; ComponentLink1URL: http://www.koaspeer.com/catimages/Products/RK73H/RK73H.pdf
R7 R12 R13 = RES_240R_0402_1%: 240R 0.063W 1% 0402 (1005 Metric); Manufacturer: KOA Speer; PartNumber: RK73H1ETTP2400F; Tolerance: 1%; Power: 0.063W; Mounting Technology: Surface Mount; PackageReference: 0402; PackageDescription: 0402 (1005 Metric); ComponentLink1Description: Datasheet; ComponentLink1URL: http://www.koaspeer.com/catimages/Products/RK73H/RK73H.pdf
R8 R9 = RES_10K_0402_1%: 10K 0.063W 1% 0402 (1005 Metric); Manufacturer: KOA Speer; PartNumber: RK73H1ETTP1002F; Tolerance: 1%; Power: 0.063W; Mounting Technology: Surface Mount; PackageReference: 0402; PackageDescription: 0402 (1005 Metric); ComponentLink1Description: Datasheet; ComponentLink1URL: http://www.koaspeer.com/catimages/Products/RK73H/RK73H.pdf
R10 R11 = RES_1K_0402_1%: 1K 0.063W 1% 0402 (1005 Metric); Manufacturer: KOA Speer; PartNumber: RK73H1ETTP1001F; Tolerance: 1%; Power: 0.063W; Mounting Technology: Surface Mount; PackageReference: 0402; PackageDescription: 0402 (1005 Metric); ComponentLink1Description: Datasheet; ComponentLink1URL: http://www.koaspeer.com/catimages/Products/RK73H/RK73H.pdf
U1 = MCIMX6X3EVO10AB: as U1 on sheet MPU-Power; PartNumber: MCIMX6X3EVO10AB; Mounting Technology: Surface Mount; PackageReference: BGA-400
U2 U3 = MT41K256M16TW-107: IC SDRAM 4GBIT 933MHZ 96FBGA; Manufacturer: Micron Technology; PartNumber: MT41K256M16TW-107; Mounting Technology: Surface Mount; PackageReference: BGA-96

## Sheet MPU-Control.SchDoc
size A
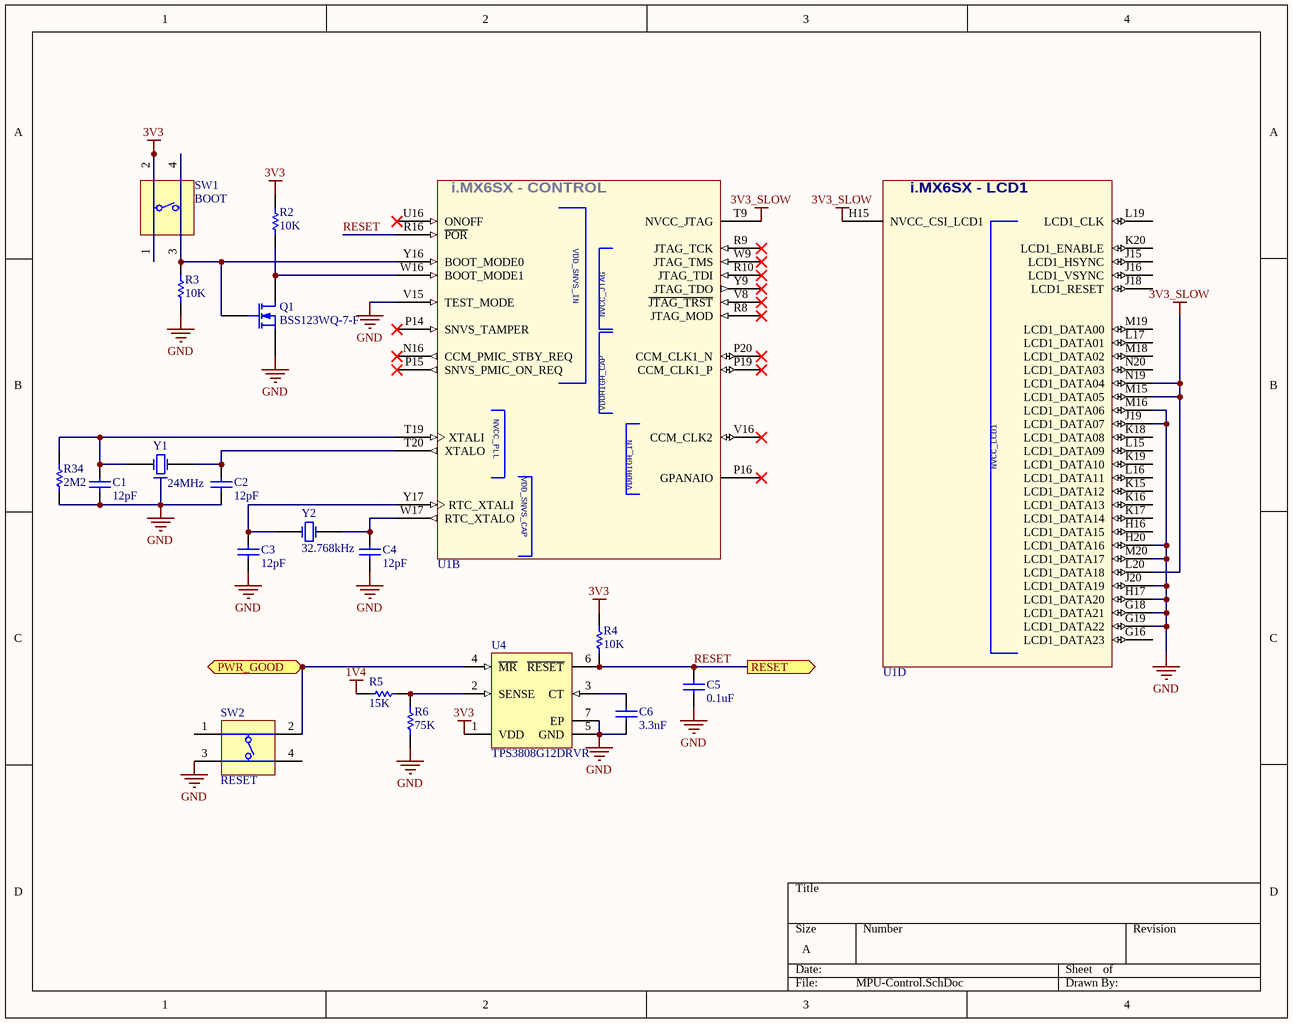
[diagram p3: MPU-Control.SchDoc]

### Parts
C1  value 12pF  [C0402[1005X55]]  (hidden comment: 12pF 50V 0402)
C2  value 12pF  [C0402[1005X55]]  (hidden comment: 12pF 50V 0402)
C3  value 12pF  [C0402[1005X55]]  (hidden comment: 12pF 50V 0402)
C4  value 12pF  [C0402[1005X55]]  (hidden comment: 12pF 50V 0402)
C5  value 0.1uF  [C0402[1005X55]]  (hidden comment: 0.1uF 6.3V 0402)
C6  value 3.3nF  [C0402[1005X55]]  (hidden comment: 3.3nF 50V 0402)
Q1  BSS123WQ-7-F  [SOT323-3]
R2  value 10K  [R0402[1005]]  (hidden comment: 10K 1% 0402)
R3  value 10K  [R0402[1005]]  (hidden comment: 10K 1% 0402)
R4  value 10K  [R0402[1005]]  (hidden comment: 10K 1% 0402)
R5  value 15K  [R0402[1005]]  (hidden comment: 15K 1% 0402)
R6  value 75K  [R0402[1005]]  (hidden comment: 75K 1% 0402)
R34  value 2M2  [R0402[1005]]  (hidden comment: 2M2 1% 0402)
SW1  BOOT  [SWITCH]
SW2  RESET  [SWITCH]
U1  MCIMX6X3EVO10AB  [BGA-400]  (value not drawn)  (parts B,D of 12)
U4  TPS3808G12DRVR  [DRV0006A_V]
Y1  24MHz  [CRYSTAL_2.0x1.6]
Y2  32.768kHz  [CRYSTAL_2.0x1.2]

### Ports
PWR_GOOD (in), RESET (out)

### Nets
1V4: R5.2
3V3: R2.2 R4.2 SW1.1(T1) SW1.2(T2) U4.1(VDD)
3V3_SLOW: U1.H15(NVCC_CSI_LCD1) U1.L20(LCD1_DATA18) U1.M15(LCD1_DATA05) U1.N19(LCD1_DATA04) U1.T9(NVCC_JTAG)
GND: C1.1 C2.1 C3.1 C4.1 C5.1 C6.1 Q1.2(S) R3.1 R6.1 R34.1 SW2.3(T3) U1.G18(LCD1_DATA21) U1.G19(LCD1_DATA22) U1.H17(LCD1_DATA20) U1.H20(LCD1_DATA16) U1.J19(LCD1_DATA07) U1.J20(LCD1_DATA19) U1.M16(LCD1_DATA06) U1.M20(LCD1_DATA17) U1.V15(TEST_MODE) U4.5(GND) U4.7(EP) Y1.2
RESET: C5.2 R4.1 U1.R16(~{POR}) U4.6(~{RESET}) ; port RESET
NetC1_2: C1.2 R34.2 U1.T19(XTALI) Y1.1(X1)
NetC2_2: C2.2 U1.T20(XTALO) Y1.3(X2)
NetC3_2: C3.2 U1.Y17(RTC_XTALI) Y2.1(X1)
NetC4_2: C4.2 U1.W17(RTC_XTALO) Y2.2(X2)
NetC6_2: C6.2 U4.3(CT)
NetQ1_1: Q1.1(G) R3.2 SW1.3(T3) SW1.4(T3) U1.Y16(BOOT_MODE0)
NetQ1_3: Q1.3(D) R2.1 U1.W16(BOOT_MODE1)
NetR5_1: R5.1 R6.2 U4.2(SENSE)
NetSW2_2: SW2.2(T2) U4.4(~{MR}) ; port PWR_GOOD

Not connected (* = marked no-connect by the designer): SW2 1(T1) 4(T3); U1 G16(LCD1_DATA23) H16(LCD1_DATA15) J15(LCD1_HSYNC) J16(LCD1_VSYNC) J18(LCD1_RESET) K15(LCD1_DATA12) K16(LCD1_DATA13) K17(LCD1_DATA14) K18(LCD1_DATA08) K19(LCD1_DATA10) K20(LCD1_ENABLE) L15(LCD1_DATA09) L16(LCD1_DATA11) L17(LCD1_DATA01) L19(LCD1_CLK) M18(LCD1_DATA02) M19(LCD1_DATA00) N16(CCM_PMIC_STBY_REQ)* N20(LCD1_DATA03) P14(SNVS_TAMPER)* P15(SNVS_PMIC_ON_REQ)* P16(GPANAIO)* P19(CCM_CLK1_P)* P20(CCM_CLK1_N)* R8(JTAG_MOD)* R9(JTAG_TCK)* R10(JTAG_TDI)* U16(ONOFF)* V8(~{JTAG_TRST})* V16(CCM_CLK2)* W9(JTAG_TMS)* Y9(JTAG_TDO)*

### Notes on the sheet
- (in symbol MCIMX6X3EVO10AB, part B) i.MX6SX - CONTROL; VDDHIGH_CAP; VDDHIGH_IN
- (in symbol MCIMX6X3EVO10AB, part D) i.MX6SX - LCD1; NVCC_LCD1

### Library data of the parts
C1-C4 = CAP_12pF_50V_0402_5%: 12pF 50V 5% 0402 (1005 Metric); PartNumber: GRM1555C1H120JA01D; Manufacturer: Murata; Mounting Technology: Surface Mount; PackageReference: 0402; PackageDescription: 0402 (1005 Metric); Voltage: 50V; Tolerance: 5%
C5 = CAP_0.1uF_6.3V_0402_10%: as C68 on sheet Supplies; Mounting Technology: Surface Mount; PackageReference: 0402; PackageDescription: 0402 (1005 Metric); Voltage: 6.3V; Tolerance: 10%
C6 = CAP_3.3nF_50V_0402_10%: as C66 on sheet Supplies; Mounting Technology: Surface Mount; PackageReference: 0402; PackageDescription: 0402 (1005 Metric); Voltage: 50V; Tolerance: 10%
Q1 = BSS123WQ-7-F: N-Channel MOSFET; Manufacturer: Diodes Incorporated; PartNumber: BSS123WQ-7-F; PackageReference: SOT-323-3; Mounting Technology: Surface Mount
R2-R4 = RES_10K_0402_1%: as R8 on sheet MPU-Memory; Tolerance: 1%; Power: 0.063W; Mounting Technology: Surface Mount; PackageReference: 0402; PackageDescription: 0402 (1005 Metric); ComponentLink1Description: Datasheet; ComponentLink1URL: http://www.koaspeer.com/catimages/Products/RK73H/RK73H.pdf
R5 = RES_15K_0402_1%: 15K 0.063W 1% 0402 (1005 Metric); Manufacturer: KOA Speer; PartNumber: RK73H1ETTP1502F; Tolerance: 1%; Power: 0.063W; Mounting Technology: Surface Mount; PackageReference: 0402; PackageDescription: 0402 (1005 Metric); ComponentLink1Description: Datasheet; ComponentLink1URL: http://www.koaspeer.com/catimages/Products/RK73H/RK73H.pdf
R6 = RES_75K_0402_1%: 75K 0.063W 1% 0402 (1005 Metric); Manufacturer: KOA Speer; PartNumber: RK73H1ETTP7502F; Tolerance: 1%; Power: 0.063W; Mounting Technology: Surface Mount; PackageReference: 0402; PackageDescription: 0402 (1005 Metric); ComponentLink1Description: Datasheet; ComponentLink1URL: http://www.koaspeer.com/catimages/Products/RK73H/RK73H.pdf
R34 = RES_2M2_0402_1%: 2M2 0.063W 1% 0402 (1005 Metric); Manufacturer: KOA Speer; PartNumber: RK73H1ETTP2204F; Tolerance: 1%; Power: 0.063W; Mounting Technology: Surface Mount; PackageReference: 0402; PackageDescription: 0402 (1005 Metric); ComponentLink1Description: Datasheet; ComponentLink1URL: http://www.koaspeer.com/catimages/Products/RK73H/RK73H.pdf
SW1 SW2 = DIPT-DTSM-6: Switch, SPNO Push Button SMD; Manufacturer: C&K Components; PartNumber: PTS810 SJM 250 SMTR LFS; Packing Type: Tape&Reel; Mechanical Life: 200,000 cycles; ComponentLink2URL: http://www.dip.com.tw/Products_tact.htm; ComponentLink1URL: http://www.dip.com.tw/; ComponentLink3URL: http://www.dip.com.tw/PDF/pro_tact/DTSM_G_-6_2_-V.pdf; PackageDescription: Switch, Surface Mount, 4 Leads, Body 4.6x2.8mm, Height 1.9mm; ComponentLink2Description: Datasheet; ComponentLink3Description: Package Specification; ComponentLink1Description: Manufacturer URL; PackageReference: PTS810; Mounting Technology: Surface Mount
U1 = MCIMX6X3EVO10AB: as U1 on sheet MPU-Power; PartNumber: MCIMX6X3EVO10AB; Mounting Technology: Surface Mount; PackageReference: BGA-400
U4 = CMP-0332-00398-2: Low Quiescent Current, Programmable-Delay Supervisory Circuit, 1 Supply Monitored, -40 to 125 degC, 6-pin SON (DRV), Green (RoHS & no Sb/Br); Manufacturer: Texas Instruments; Threshold Voltage 1 (typ)(Typ)(V): 1.12; # of Supplies Monitored: 1; VCC(Max)(V): 6.5; Iq(Typ)(uA): 2.4; SubFamily: Supervisor and Reset IC; Reset Threshold Accuracy(%): 0.5; VCC(Min)(V): 1.7; Rating: Catalog; Output Driver Type / Reset Output: Active-low, Open-drain; Time Delay(ms): Programmable; Mounting Technology: Surface Mount; PackageDescription: 6-Pin Plastic Small Outline No-Lead, 2 x 2 x 0.8 mm Body, 0.65 mm Pitch, Exposed Pad; PartNumber: TPS3808G12DRVR; ComponentLink1Description: Datasheet; PackageVersion: revE, Oct-2010; ComponentLink1URL: http://www.ti.com/general/docs/lit/getliterature.tsp?genericPartNumber=TPS3808G12&fileType=pdf; PackageReference: DRV0006A; DatasheetVersion: SBVS050J
Y1 = FA-128 24.0000MF10Z-W3: Manufacturer: EPSON; PartNumber: FA-128 24.0000MF10Z-W3; Mounting Technology: Surface Mount; PackageReference: 4-SMD
Y2 = ABS06-32.768KHZ-9-1-T: Manufacturer: Abracon; PartNumber: ABS06-32.768KHZ-9-1-T; Mounting Technology: Surface Mount; PackageReference: 4-SMD

## Nets that join several sheets
1V4: Supplies (6 pins), MPU-Power (22 pins), MPU-Memory (64 pins), MPU-Control (R5.2)
2V5: MPU-Power (C54.2 C55.2 U1.N17 U1.N18), MPU-Memory (U1.K7)
3V3: Supplies (6 pins), MPU-Power (5 pins), MPU-Control (5 pins)
3V3_SLOW: Supplies (C65.1 L3.2 U7.10), MPU-Control (5 pins)
GND: Supplies (24 pins), MPU-Power (94 pins), MPU-Memory (72 pins), MPU-Control (23 pins)